# EAGLE schematic ArduinoGuitarEffect (EAGLE 9.6.2)
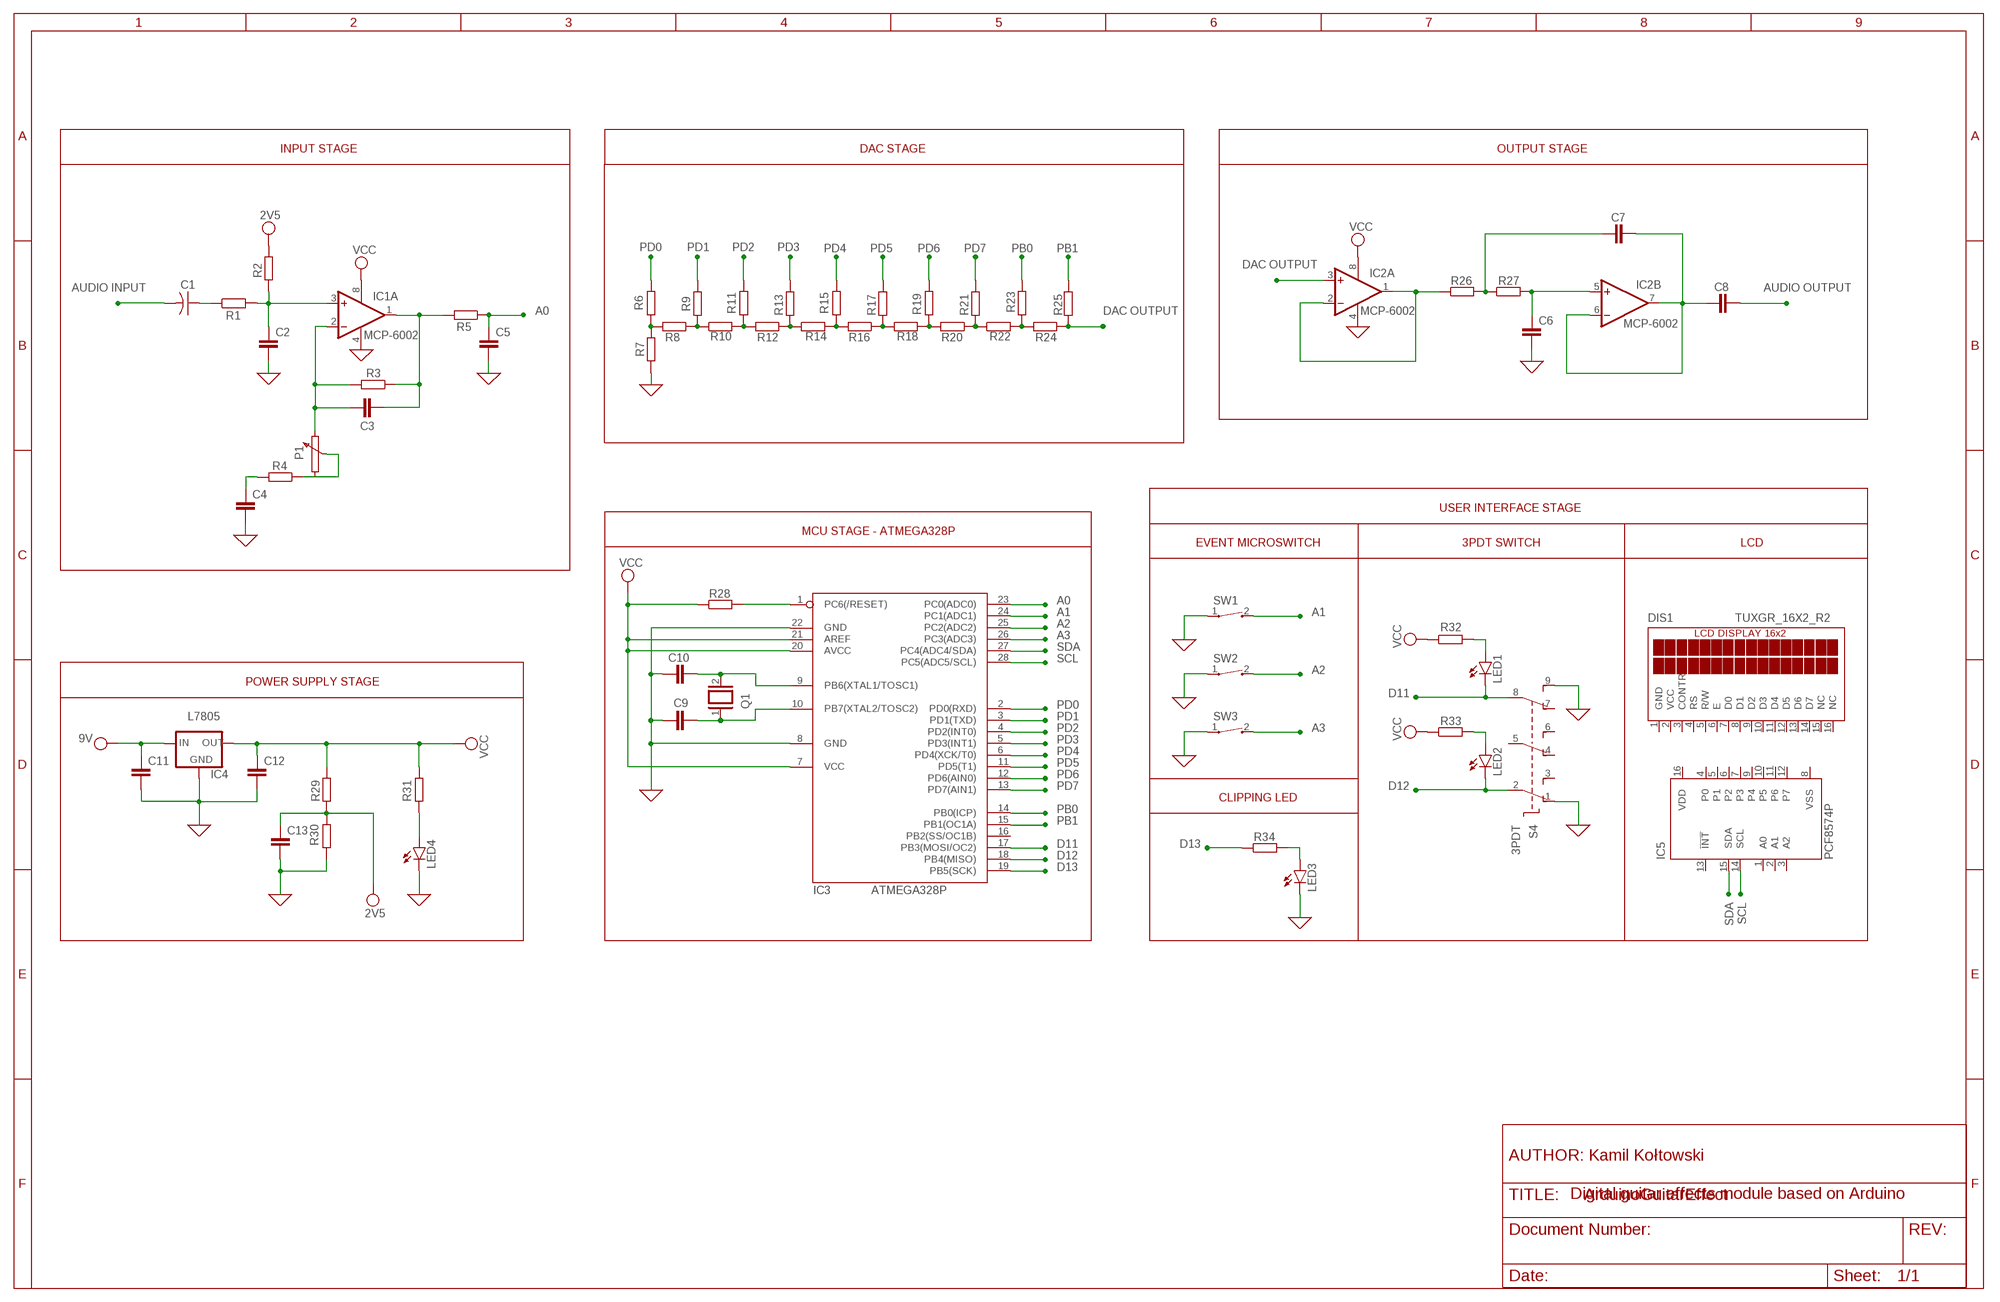
[diagram p0: schematic, sheet 1]
FRAME1 (FRAME_B_L): PROJECT_NAME: Digital effects module based on Arduino

## Parts
C1  C-US025-024X044  [C025-024X044]
C2  C-EU025-024X044  [C025-024X044]
C3  C-EU025-024X044  [C025-024X044]
C4  C-EU025-024X044  [C025-024X044]
C5  C-EU025-024X044  [C025-024X044]
C6  C-EU025-024X044  [C025-024X044]
C7  C-EU025-024X044  [C025-024X044]
C8  C-EU025-024X044  [C025-024X044]
C9  C-EU025-024X044  [C025-024X044]
C10  C-EU025-024X044  [C025-024X044]
C11  C-EU025-024X044  [C025-024X044]
C12  C-EU025-024X044  [C025-024X044]
C13  C-EU025-024X044  [C025-024X044]
DIS1  TUXGR_16X2_R2  [TUXGR_16X2_R2]
IC1  MCP602P  [DIL08]
IC2  MCP602P  [DIL08]
IC3  MEGA8-P  [DIL28-3]
IC4  78XXS  [78XXS]
IC5  PCF8574P  [DIL16]
LED1  TLLG4400  [LED3MM]
LED2  TLLG4400  [LED3MM]
LED3  TLLG4400  [LED3MM]
LED4  TLLG4400  [LED3MM]
Q1  XTAL/S  [QS]
R1  R-EU_0204/7  [0204/7]
R2  R-EU_0204/7  [0204/7]
R3  R-EU_0204/7  [0204/7]
R4  R-EU_0204/7  [0204/7]
R5  R-EU_0204/7  [0204/7]
R6  R-EU_0204/7  [0204/7]
R7  R-EU_0204/7  [0204/7]
R8  R-EU_0204/7  [0204/7]
R9  R-EU_0204/7  [0204/7]
R10  R-EU_0204/7  [0204/7]
R11  R-EU_0204/7  [0204/7]
R12  R-EU_0204/7  [0204/7]
R13  R-EU_0204/7  [0204/7]
R14  R-EU_0204/7  [0204/7]
R15  R-EU_0204/7  [0204/7]
R16  R-EU_0204/7  [0204/7]
R17  R-EU_0204/7  [0204/7]
R18  R-EU_0204/7  [0204/7]
R19  R-EU_0204/7  [0204/7]
R20  R-EU_0204/7  [0204/7]
R21  R-EU_0204/7  [0204/7]
R22  R-EU_0204/7  [0204/7]
R23  R-EU_0204/7  [0204/7]
R24  R-EU_0204/7  [0204/7]
R25  R-EU_0204/7  [0204/7]
R26  R-EU_0204/7  [0204/7]
R27  R-EU_0204/7  [0204/7]
R28  R-EU_0204/7  [0204/7]
R29  R-EU_0204/7  [0204/7]
R30  R-EU_0204/7  [0204/7]
R31  R-EU_0204/7  [0204/7]
R32  R-EU_0204/7  [0204/7]
R33  R-EU_0204/7  [0204/7]
R34  R-EU_0204/7  [0204/7]
S4  3PDT  [3PDT]
SW1  CT10-XXXX-G4  [CT10-XXXX-G4]
SW2  CT10-XXXX-G4  [CT10-XXXX-G4]
SW3  CT10-XXXX-G4  [CT10-XXXX-G4]

## Nets
0: C2.2 C4.2 C5.2 C6.2 C9.1 C10.1 C11.2 C12.2 C13.2 IC1.4(P:V-) IC2.4(P:V-) IC3.8(GND) IC3.22(GND) IC4.GND LED3.K(C) LED4.K(C) R7.1 R30.1 S4.1(O1) S4.9(S3) SW1.1 SW2.1 SW3.1 ; supply symbol labelled GND
A0: C5.1 IC3.23(PC0(ADC0)) R5.1
A1: IC3.24(PC1(ADC1)) SW1.2
A2: IC3.25(PC2(ADC2)) SW2.2
A3: IC3.26(PC3(ADC3)) SW3.2
AUDIO_INPUT: C1.2
D11: IC3.17(PB3(MOSI/OC2)) LED1.K(C) S4.8(P3)
D12: IC3.18(PB4(MISO)) LED2.K(C) S4.2(P1)
D13: IC3.19(PB5(SCK)) R34.1
N$1: R6.1 R7.2 R8.2
N$2: C1.1 R1.1
N$3: C3.2 IC1.2(A:-IN) R3.2
N$4: C3.1 IC1.1(A:OUT) R3.1 R5.2
N$5: C2.1 IC1.3(A:+IN) R1.2 R2.1
N$6: R8.1 R9.2 R10.1
N$7: C4.1 R4.2
N$8: R10.2 R11.1 R12.2
N$9: R12.1 R13.2 R14.1
N$10: R14.2 R15.1 R16.2
N$11: R16.1 R17.2 R18.1
N$12: R18.2 R19.1 R20.2
N$13: R20.1 R21.2 R22.1
N$14: R22.2 R23.1 R24.2
N$16: IC2.3(A:+IN)
N$17: R24.1 R25.2
N$18: C10.2 IC3.9(PB6(XTAL1/TOSC1)) Q1.2
N$19: C9.2 IC3.10(PB7(XTAL2/TOSC2)) Q1.1
N$20: C13.1 R29.1 R30.2 ; supply symbol labelled VCC
N$21: IC2.1(A:OUT) IC2.2(A:-IN) R26.1
N$22: C7.1 R26.2 R27.1
N$23: C6.1 IC2.5(B:+IN) R27.2
N$24: C7.2 C8.1 IC2.6(B:-IN) IC2.7(B:OUT)
N$25: C8.2
N$26: LED4.A R31.1
N$27: LED1.A R32.2
N$28: LED2.A R33.2
N$29: IC3.1(PC6(/RESET)) R28.2
N$30: LED3.A R34.2
N$31: R4.1
PB0: IC3.14(PB0(ICP)) R23.2
PB1: IC3.15(PB1(OC1A)) R25.1
PD0: IC3.2(PD0(RXD)) R6.2
PD1: IC3.3(PD1(TXD)) R9.1
PD2: IC3.4(PD2(INT0)) R11.2
PD3: IC3.5(PD3(INT1)) R13.1
PD4: IC3.6(PD4(XCK/T0)) R15.2
PD5: IC3.11(PD5(T1)) R17.1
PD6: IC3.12(PD6(AIN0)) R19.2
PD7: IC3.13(PD7(AIN1)) R21.1
SCL: IC3.28(PC5(ADC5/SCL)) IC5.14(SCL)
SDA: IC3.27(PC4(ADC4/SDA)) IC5.15(SDA)
VCC: C11.1 C12.1 IC1.8(P:V+) IC2.8(P:V+) IC3.7(VCC) IC3.20(AVCC) IC3.21(AREF) IC4.IN IC4.OUT R2.2 R28.1 R29.2 R31.2 R32.1 R33.1 ; supply symbol labelled 2V5
Unconnected: DIS1.3(CONTR) DIS1.4(RS) DIS1.5(R/W) DIS1.6(E) DIS1.7(D0) DIS1.8(D1) DIS1.9(D2) DIS1.10(D3) DIS1.11(D4) DIS1.12(D5) DIS1.13(D6) DIS1.14(D7) DIS1.15(NC) DIS1.16(NC) IC1.5(B:+IN) IC1.6(B:-IN) IC1.7(B:OUT) IC3.16(PB2(SS/OC1B)) IC5.1(A0) IC5.2(A1) IC5.3(A2) IC5.4(P0) IC5.5(P1) IC5.6(P2) IC5.7(P3) IC5.9(P4) IC5.10(P5) IC5.11(P6) IC5.12(P7) IC5.13(!INT) S4.3(S1) S4.4(O2) S4.5(P2) S4.6(S2) S4.7(O3)

## Notes on the sheet
- INPUT STAGE | DAC STAGE | OUTPUT STAGE
- DAC OUTPUT
- AUDIO INPUT | AUDIO OUTPUT
- DAC OUTPUT | MCP-6002
- MCP-6002
- MCP-6002
- P1
- USER INTERFACE STAGE
- MCU STAGE - ATMEGA328P
- EVENT MICROSWITCH | 3PDT SWITCH | LCD
- POWER SUPPLY STAGE
- L7805
- 9V
- CLIPPING LED
- ATMEGA328P
- 2V5
- AUTHOR: Kamil Kołtowski
- Digital guitar effects module based on Arduino

## Power pins joined to a net without a drawn wire
GND: DIS1.1(GND)
VCC: DIS1.2(VCC)
VDD: IC5.16(VDD)
VSS: IC5.8(VSS)

## Library data of the parts
C1 = rcl:C-US: CAPACITOR, American symbol; SPICEPREFIX: C
C2-C13 = rcl:C-EU: CAPACITOR, European symbol; SPICEPREFIX: C
DIS1 = display-lcd:TUXGR_16X2_R2: Tuxgraphics LCD display 16x2 characters reflective, without background light Source: tuxgr_12x2_r2.pdf; OC_FARNELL: unknown; OC_NEWARK: unknown
IC1 IC2 = linear:MCP602: Single Op Amp 2.7V to 6.0V Single Supply CMOS Source: http://ww1.microchip.com/downloads/en/DeviceDoc/21314g.pdf
IC3 = atmel:MEGA8-P: MICROCONTROLLER 8 Kbytes FLASH, 1 kbytes SRAM, 512 bytes EEPROM, USART, 4-channel 10 bit ADC, 2-channel 8 bit ADC Pin compatible with Atmega48, ATMega88, ATMega168 Source: avr.lbr; OC_FARNELL: unknown; OC_NEWARK: unknown
IC4 = v-reg:78XXS: VOLTAGE REGULATOR
IC5 = micro-philips:PCF8574: I2C-Bus Remote 8-bit I/O expander http://www.semiconductors.philips.com/acrobat_download/datasheets/PCF8574_4.pdf; MPN: PCF8574PN; OC_FARNELL: 204020; OC_NEWARK: 11N8515
LED1-LED4 = led:TLLG4400: Low Current (2mA) LED 3 mm Tinted Diffused Package color GREEN Source: Data sheet <http://www.farnell.com/datasheets/391098.pdf>; MF: VISHAY SEMICONDUCTOR; OC_FARNELL: 1612435
Q1 = special:XTAL/S: CRYSTAL
R1-R34 = rcl:R-EU_: RESISTOR, European symbol; SPICEPREFIX: R
S4 = switch:3PDT: 3PDT 9 pin footswitch SF17020F-0302-21R-L Source: 3PDT.jpg
SW1-SW3 = switch-coto:CT10-XXXX-: CT10 Series Molded Switch Source: www.cotorelay.com .. Coto_Technology__CT10-1530-G1.pdf